# Altium schematic sheet AD7175-8.SchDoc
size 297 x 209 mm
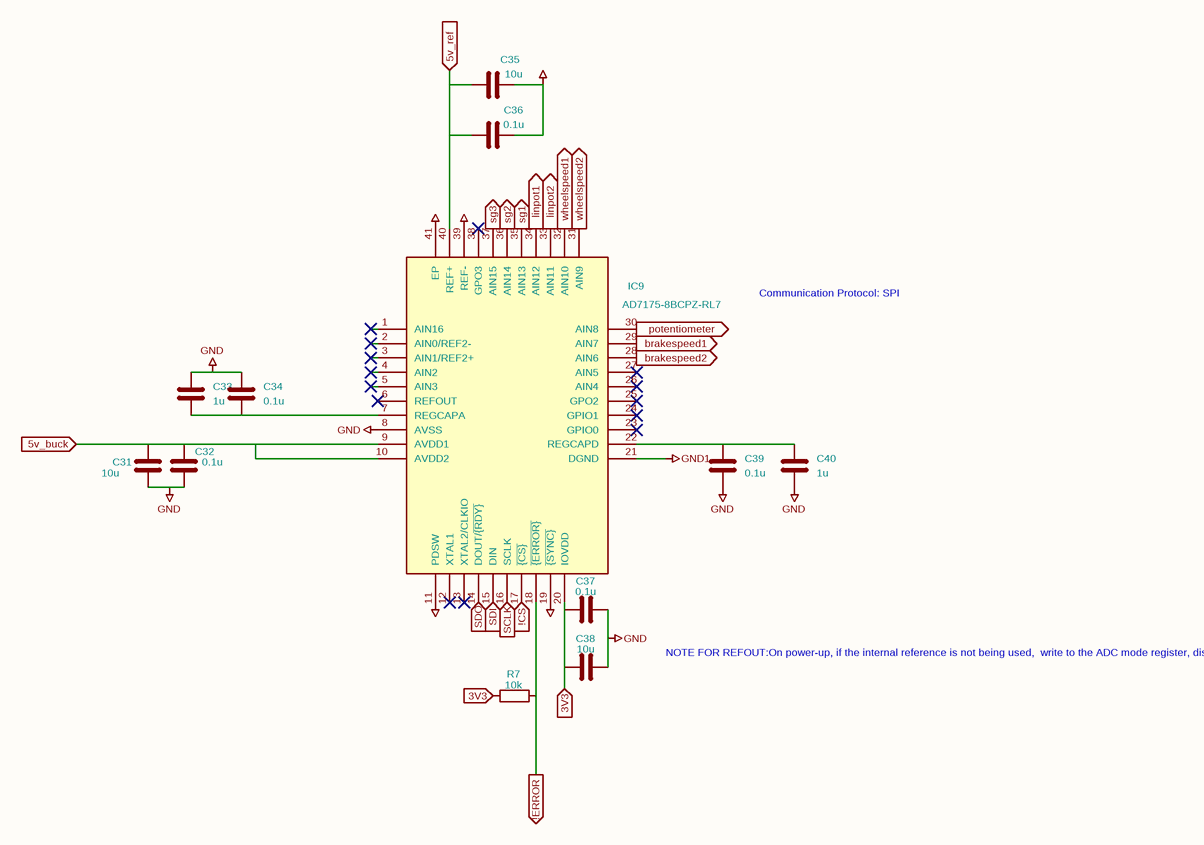
[diagram p0: AD7175-8.SchDoc]

## Parts
C31  10u  [C_0603_1608Metric]
C32  0.1u  [C_0603_1608Metric]
C33  1u  [C_0603_1608Metric]
C34  0.1u  [C_0603_1608Metric]
C35  10u  [C_0603_1608Metric]
C36  0.1u  [C_0603_1608Metric]
C37  0.1u  [C_0603_1608Metric]
C38  10u  [C_0603_1608Metric]
C39  0.1u  [C_0603_1608Metric]
C40  1u  [C_0603_1608Metric]
IC9  AD7175-8BCPZ-RL7  [QFN50P600X600X80-41N]
R7  10k  [R_0603_1608Metric]

## Ports
3V3 (in), 5v_buck (in), 5v_ref (in), !CS (in), !ERROR (out), brakespeed1 (in), brakespeed2 (in), linpot1 (in), linpot2 (in), potentiometer (in), SCLK (in), SDI (in), SDO (out), sg1 (in), sg2 (in), sg3 (in), wheelspeed1 (in), wheelspeed2 (in)

## Nets
GND: C31.2 C32.2 C33.1 C34.1 C35.2 C36.2 C37.2 C38.2 C39.2 C40.2 IC9.8(AVSS) IC9.11(PDSW) IC9.19(~{{SYNC}}) IC9.39(REF-) IC9.41(EP)
GND1: IC9.21(DGND)
3V3: C37.1 C38.1 IC9.20(IOVDD) R7.1 ; port 3V3
5v_buck: C31.1 C32.1 IC9.9(AVDD1) IC9.10(AVDD2) ; port 5v_buck
5v_ref: C35.1 C36.1 IC9.40(REF+) ; port 5v_ref
!CS: IC9.17(~{{CS}}) ; port !CS
!ERROR: IC9.18(~{{ERROR}}) R7.2 ; port !ERROR
brakespeed1: IC9.29(AIN7) ; port brakespeed1
brakespeed2: IC9.28(AIN6) ; port brakespeed2
linpot1: IC9.34(AIN12) ; port linpot1
linpot2: IC9.33(AIN11) ; port linpot2
potentiometer: IC9.30(AIN8) ; port potentiometer
SCLK: IC9.16(SCLK) ; port SCLK
SDI: IC9.15(DIN) ; port SDI
SDO: IC9.14(DOUT/~{{RDY}}) ; port SDO
sg1: IC9.35(AIN13) ; port sg1
sg2: IC9.36(AIN14) ; port sg2
sg3: IC9.37(AIN15) ; port sg3
wheelspeed1: IC9.32(AIN10) ; port wheelspeed1
wheelspeed2: IC9.31(AIN9) ; port wheelspeed2
NetC33_2: C33.2 C34.2 IC9.7(REGCAPA)
NetC39_1: C39.1 C40.1 IC9.22(REGCAPD)

Not connected (* = marked no-connect by the designer): IC9 1(AIN16)* 2(AIN0/REF2-)* 3(AIN1/REF2+)* 4(AIN2)* 5(AIN3)* 6(REFOUT)* 12(XTAL1)* 13(XTAL2/CLKIO)* 23(GPIO0)* 24(GPIO1)* 25(GPO2)* 26(AIN4)* 27(AIN5)* 38(GPO3)*

## Notes on the sheet
- Communication Protocol: SPI
- NOTE FOR REFOUT:On power-up, if the internal reference is not being used,
  write to the ADC mode register, disabling the internal reference.
  This is controlled by the REF_EN bit (Bit 15) in the ADC mode register
- 1
- 2
- 3
- 4
- 5
- 6
- A
- B
- C
- D
- Title:
- File: AD7175-8.kicad_sch
- Sheet: /
- KiCad E.D.A.  kicad (5.1.4)-1
- Size: A4
- Date:
- Rev:
- Id: 1/1

## Library data of the parts
C31-C40 = C: Footprint: Capacitor_SMD:C_0603_1608Metric
  C31 C35 C38: Value: 10u
  C32 C34 C36 C37 C39: Value: 0.1u
  C33 C40: Value: 1u
IC9 = AD7175-8BCPZ-RL7: Manufacturer_Name: Analog Devices; Height: 0.8; Mouser Part Number: 584-AD7175-8BCPZ-RL7; Mouser Price/Stock: https://www.mouser.co.uk/ProductDetail/Analog-Devices/AD7175-8BCPZ-RL7?qs=JeIcUl65ClCxXjl02vXI6Q%3D%3D; Manufacturer_Part_Number: AD7175-8BCPZ-RL7; Value: AD7175-8BCPZ-RL7; Footprint: 21xt_footprints:QFN50P600X600X80-41N
R7 = R: Value: 10k; Footprint: Resistor_SMD:R_0603_1608Metric